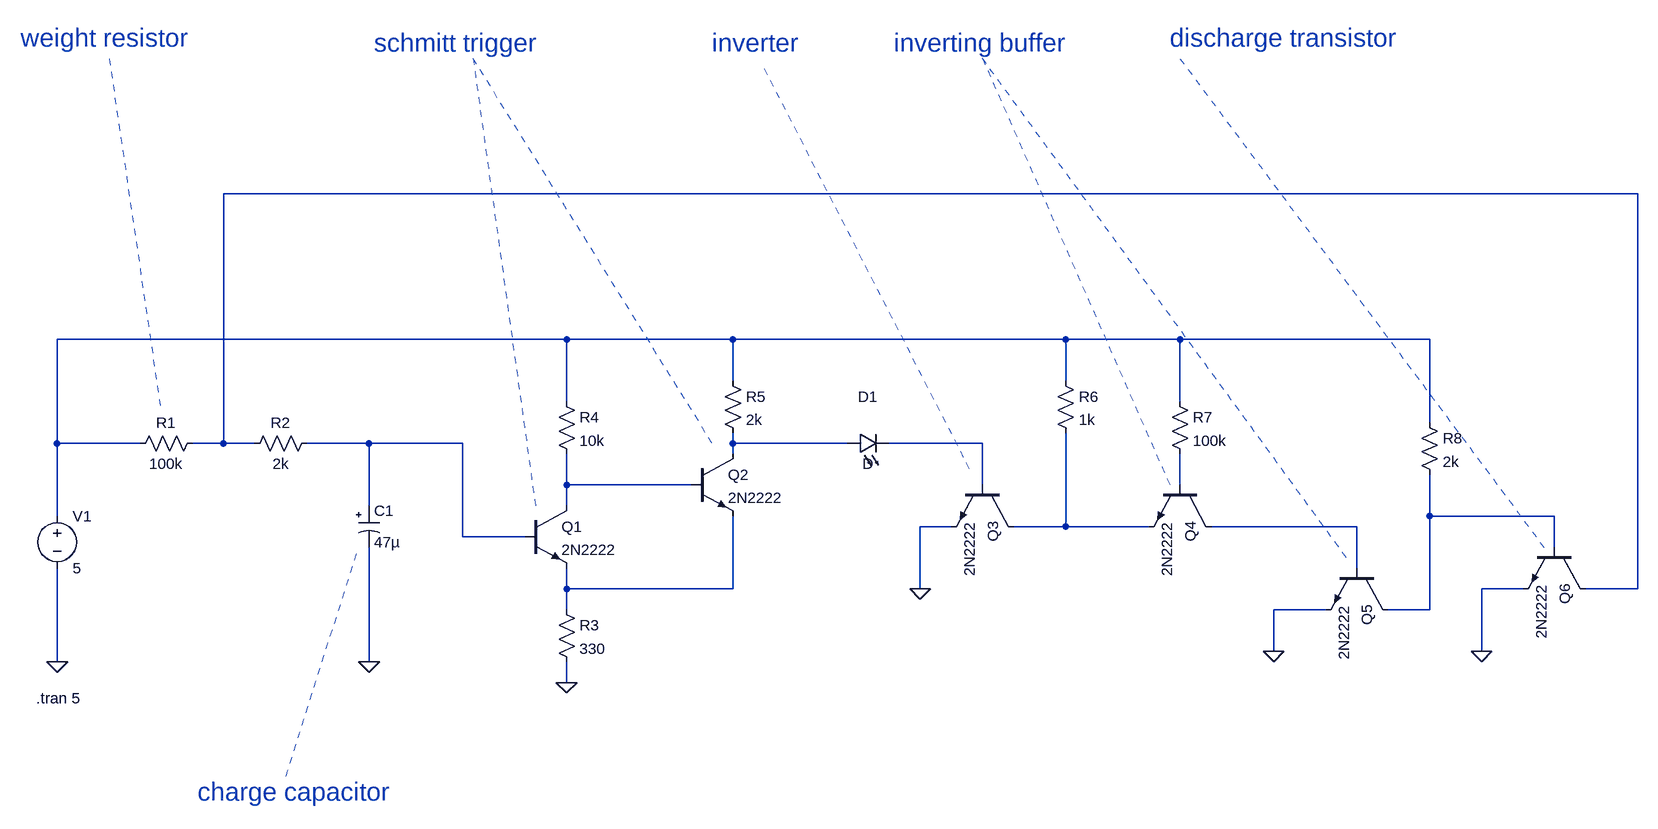
[diagram p0: schematic good_neuron.asc]
good_neuron.asc, the LTspice schematic file:
Version 4.1
SHEET 1 2244 680
WIRE 2240 -320 64 -320
WIRE 592 -96 -192 -96
WIRE 848 -96 592 -96
WIRE 1360 -96 848 -96
WIRE 1536 -96 1360 -96
WIRE 1920 -96 1536 -96
WIRE 848 -32 848 -96
WIRE 1360 -32 1360 -96
WIRE 592 0 592 -96
WIRE 1536 0 1536 -96
WIRE 1920 32 1920 -96
WIRE -192 64 -192 -96
WIRE -64 64 -192 64
WIRE 64 64 64 -320
WIRE 64 64 16 64
WIRE 112 64 64 64
WIRE 288 64 192 64
WIRE 432 64 288 64
WIRE 848 64 848 48
WIRE 1024 64 848 64
WIRE 1232 64 1088 64
WIRE 848 80 848 64
WIRE 592 128 592 80
WIRE 784 128 592 128
WIRE 1232 128 1232 64
WIRE 1536 128 1536 80
WIRE 288 160 288 64
WIRE 592 160 592 128
WIRE -192 176 -192 64
WIRE 1920 176 1920 112
WIRE 2112 176 1920 176
WIRE 1184 192 1136 192
WIRE 1360 192 1360 48
WIRE 1360 192 1280 192
WIRE 1488 192 1360 192
WIRE 1808 192 1584 192
WIRE 432 208 432 64
WIRE 528 208 432 208
WIRE 2112 224 2112 176
WIRE 1808 256 1808 192
WIRE 592 288 592 256
WIRE 848 288 848 176
WIRE 848 288 592 288
WIRE 1136 288 1136 192
WIRE 2064 288 2000 288
WIRE 2240 288 2240 -320
WIRE 2240 288 2160 288
WIRE 592 320 592 288
WIRE 1760 320 1680 320
WIRE 1920 320 1920 176
WIRE 1920 320 1856 320
WIRE 1680 384 1680 320
WIRE 2000 384 2000 288
WIRE -192 400 -192 256
WIRE 288 400 288 224
WIRE 592 432 592 400
FLAG -192 400 0
FLAG 288 400 0
FLAG 592 432 0
FLAG 1136 288 0
FLAG 1680 384 0
FLAG 2000 384 0
SYMBOL npn 528 160 R0
SYMATTR InstName Q1
SYMATTR Value 2N2222
SYMBOL voltage -192 160 R0
WINDOW 123 0 0 Left 0
WINDOW 39 0 0 Left 0
SYMATTR InstName V1
SYMATTR Value 5
SYMBOL res 32 48 R90
WINDOW 0 0 56 VBottom 2
WINDOW 3 32 56 VTop 2
SYMATTR InstName R1
SYMATTR Value 100k
SYMBOL res 208 48 R90
WINDOW 0 0 56 VBottom 2
WINDOW 3 32 56 VTop 2
SYMATTR InstName R2
SYMATTR Value 2k
SYMBOL polcap 272 160 R0
SYMATTR InstName C1
SYMATTR Value 47µ
SYMBOL res 576 304 R0
SYMATTR InstName R3
SYMATTR Value 330
SYMBOL res 576 -16 R0
SYMATTR InstName R4
SYMATTR Value 10k
SYMBOL npn 784 80 R0
SYMATTR InstName Q2
SYMATTR Value 2N2222
SYMBOL res 832 -48 R0
SYMATTR InstName R5
SYMATTR Value 2k
SYMBOL LED 1024 80 R270
WINDOW 0 72 32 VTop 2
WINDOW 3 0 32 VBottom 2
SYMATTR InstName D1
SYMBOL npn 1280 128 R90
SYMATTR InstName Q3
SYMATTR Value 2N2222
SYMBOL res 1344 -48 R0
SYMATTR InstName R6
SYMATTR Value 1k
SYMBOL npn 1584 128 R90
SYMATTR InstName Q4
SYMATTR Value 2N2222
SYMBOL res 1520 -16 R0
SYMATTR InstName R7
SYMATTR Value 100k
SYMBOL npn 1856 256 R90
SYMATTR InstName Q5
SYMATTR Value 2N2222
SYMBOL res 1904 16 R0
SYMATTR InstName R8
SYMATTR Value 2k
SYMBOL npn 2160 224 R90
SYMATTR InstName Q6
SYMATTR Value 2N2222
TEXT -224 456 Left 2 !.tran 5
TEXT 296 -552 Left 4 ;schmitt trigger
TEXT 816 -552 Left 4 ;inverter
TEXT 1096 -552 Left 4 ;inverting buffer
TEXT 1520 -560 Left 4 ;discharge transistor
TEXT -248 -560 Left 4 ;weight resistor
TEXT 24 600 Left 4 ;charge capacitor
LINE Normal 448 -528 544 160 2
LINE Normal 816 64 448 -528 2
LINE Normal 896 -512 1216 112 2
LINE Normal 1232 -528 1520 128 2
LINE Normal 1792 240 1232 -528 2
LINE Normal 1536 -528 2096 224 2
LINE Normal -112 -528 -32 16 2
LINE Normal 160 576 272 224 2

The netlist it stands for:
* good_neuron.asc
Q1 N006 N003 N011 0 2N2222
V1 N002 0 5
R1 N001 N002 100k
R2 N003 N001 2k
C1 N003 0 47µ
R3 N011 0 330
R4 N002 N006 10k
Q2 N004 N006 N011 0 2N2222
R5 N002 N004 2k
D1 N004 N005 D
Q3 N009 N005 0 0 2N2222
R6 N002 N009 1k
Q4 N010 N007 N009 0 2N2222
R7 N002 N007 100k
Q5 N008 N010 0 0 2N2222
R8 N002 N008 2k
Q6 N001 N008 0 0 2N2222
.model D D
.lib standard.dio
.model NPN NPN
.model PNP PNP
.lib standard.bjt
.tran 5
* schmitt trigger
* inverter
* inverting buffer
* discharge transistor
* weight resistor
* charge capacitor
.backanno
.end